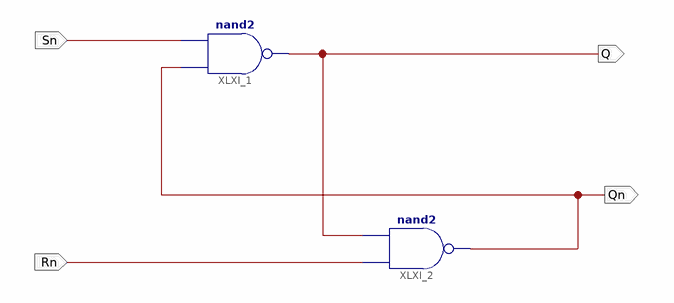
[diagram p0: schematic sheet 1]
// Xilinx ISE schematic RS_NAND.sch (spartan3) as structural Verilog: 2 symbols, 4 ports
module RS_NAND (
  input  Sn,
  input  Rn,
  output Q,
  output Qn
);

  nand XLXI_1 (Q, Qn, Sn);
  nand XLXI_2 (Qn, Rn, Q);
endmodule
